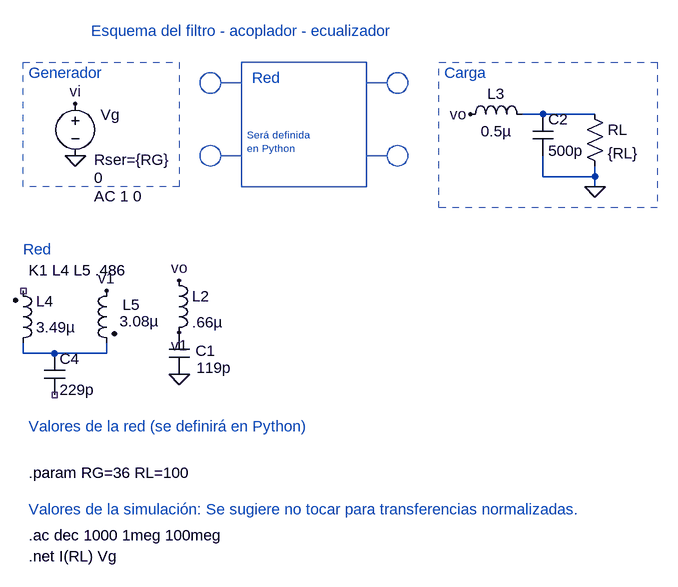
[diagram p0: schematic spar broadband fig 9.23.asc]
spar broadband fig 9.23.asc, the LTspice schematic file:
Version 4
SHEET 1 932 680
WIRE 752 -256 720 -256
WIRE 832 -256 752 -256
WIRE 752 -160 752 -192
WIRE 832 -160 832 -176
WIRE 832 -160 752 -160
WIRE 832 -144 832 -160
WIRE -48 112 -48 96
WIRE 0 112 -48 112
WIRE 80 112 80 96
WIRE 80 112 0 112
FLAG 32 -192 0
FLAG 192 144 0
FLAG 832 -144 0
FLAG 32 -272 vi
FLAG 640 -256 vo
FLAG 192 80 v1
FLAG 192 0 vo
FLAG 80 16 v1
SYMBOL voltage 32 -288 R0
WINDOW 3 29 130 Left 2
WINDOW 123 29 158 Left 2
WINDOW 39 29 102 Left 2
WINDOW 0 39 33 Left 2
SYMATTR Value 0
SYMATTR Value2 AC 1 0
SYMATTR SpiceLine Rser={RG}
SYMATTR InstName Vg
SYMBOL res 816 -272 R0
SYMATTR InstName RL
SYMATTR Value {RL}
SYMBOL cap 176 80 R0
WINDOW 0 41 28 Left 2
WINDOW 3 43 54 Left 2
SYMATTR InstName C1
SYMATTR Value 119p
SYMBOL cap 736 -256 R0
SYMATTR InstName C2
SYMATTR Value 500p
SYMBOL ind 624 -240 R270
WINDOW 0 32 56 VTop 2
WINDOW 3 5 56 VBottom 2
SYMATTR InstName L3
SYMATTR Value 0.5µ
SYMBOL ind 176 -16 R0
SYMATTR InstName L2
SYMATTR Value .66µ
SYMBOL ind2 -64 112 M180
WINDOW 0 36 80 Left 2
WINDOW 3 36 40 Left 2
SYMATTR InstName L4
SYMATTR Value 3.49µ
SYMBOL ind2 96 0 M0
WINDOW 0 -36 37 Left 2
WINDOW 3 -65 63 Left 2
SYMATTR InstName L5
SYMATTR Value 3.08µ
SYMBOL cap -16 112 R0
SYMATTR InstName C4
SYMATTR Value 229p
TEXT -40 424 Left 2 !.net I(RL) Vg
TEXT -40 392 Left 2 !.ac dec 1000 1meg 100meg
TEXT 304 -312 Left 2 ;Red
TEXT -40 -320 Left 2 ;Generador
TEXT 600 -320 Left 2 ;Carga
TEXT 296 -224 Left 1 ;Será definida \nen Python
TEXT -40 224 Left 2 ;Valores de la red (se definirá en Python)
TEXT -40 296 Left 2 !.param RG=36 RL=100
TEXT 56 -384 Left 2 ;Esquema del filtro - acoplador - ecualizador
TEXT -40 352 Left 2 ;Valores de la simulación: Se sugiere no tocar para transferencias normalizadas.
TEXT -48 -48 Left 2 ;Red
TEXT -40 -16 Left 2 !K1 L4 L5 .486
LINE Normal 288 -304 256 -304
LINE Normal 288 -192 256 -192
LINE Normal 480 -192 512 -192
LINE Normal 480 -304 512 -304
RECTANGLE Normal 480 -144 288 -336
RECTANGLE Normal 192 -144 -48 -336 2
RECTANGLE Normal 928 -112 592 -336 2
CIRCLE Normal 256 -288 224 -320
CIRCLE Normal 256 -176 224 -208
CIRCLE Normal 512 -208 544 -176
CIRCLE Normal 512 -320 544 -288

The netlist it stands for:
* spar broadband fig 9.23.asc
Vg vi 0 0 AC 1 0 Rser={RG}
RL N001 0 {RL}
C1 v1 0 119p
C2 N001 0 500p
L3 vo N001 0.5µ
L2 vo v1 .66µ
L4 N002 NC_01 3.49µ
L5 v1 N002 3.08µ
C4 N002 NC_02 229p
.net I(RL) Vg
.ac dec 1000 1meg 100meg
* Red
* Generador
* Carga
* Será definida
* en Python
* Valores de la red (se definirá en Python)
.param RG=36 RL=100
* Esquema del filtro - acoplador - ecualizador
* Valores de la simulación: Se sugiere no tocar para transferencias normalizadas.
* Red
K1 L4 L5 .486
.backanno
.end